# EAGLE design TPS2511 (EAGLE 6.4)
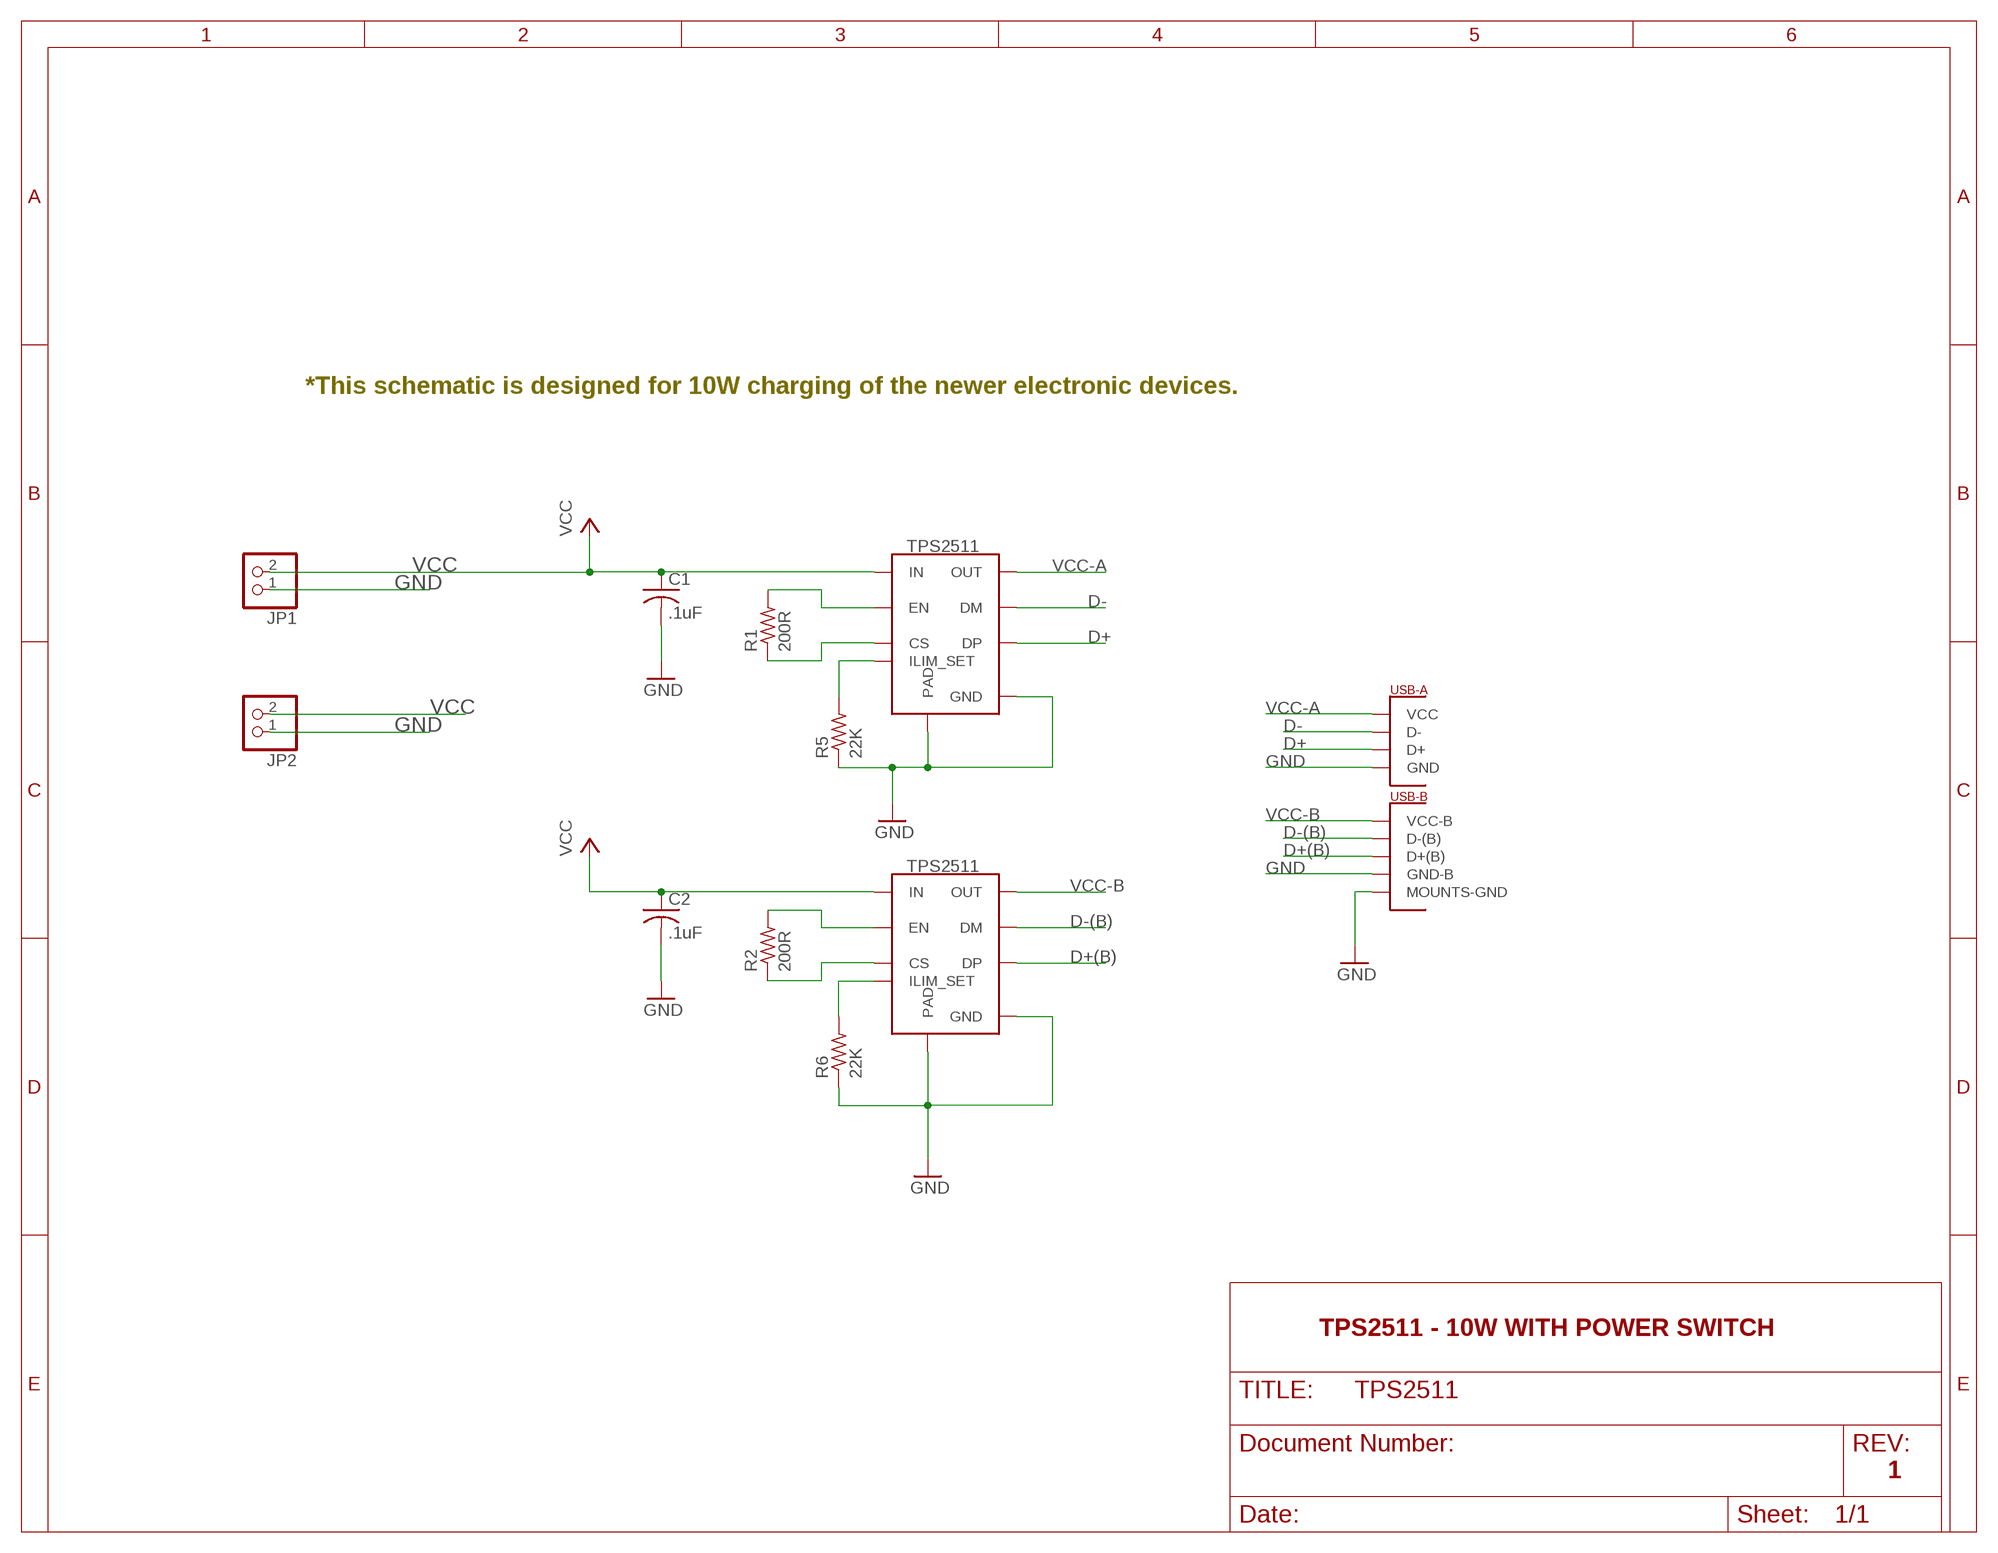
[diagram p0: schematic, sheet 1]

## Parts
C1  .1uF  C-US050-024X044  [C050-024X044]
C2  .1uF  C-US050-024X044  [C050-024X044]
JP1  PINHD-1X2/90  [1X02/90]
JP2  PINHD-1X2/90  [1X02/90]
R1  200R  R-US_0204/7  [0204/7]
R2  200R  R-US_0204/7  [0204/7]
R5  22K  R-US_0204/7  [0204/7]
R6  22K  R-US_0204/7  [0204/7]
U$1  TPS2511-MSOP8  [MSOP-8]
U$2  DUAL-PORT-USB-REC  [DUAL-PORT-USB]
U$3  TPS2511-MSOP8  [MSOP-8]

## Nets
D+: U$1.P$6(DP) U$2.P$8(D+)
D+(B): U$2.P$6(D+(B)) U$3.P$6(DP)
D-: U$1.P$7(DM) U$2.P$7(D-)
D-(B): U$2.P$5(D-(B)) U$3.P$7(DM)
GND: C1.2 C2.2 JP1.1 JP2.1 R5.1 R6.1 U$1.P$1(GND) U$1.P$9(PAD) U$2.GND(MOUNTS-GND) U$2.P$2(MOUNTS-GND) U$2.P$3(MOUNTS-GND) U$2.P$4(MOUNTS-GND) U$2.P$9(GND-B) U$2.P$11(GND) U$3.P$1(GND) U$3.P$9(PAD)
N$1: R5.2 U$1.P$2(ILIM_SET)
N$6: R6.2 U$3.P$2(ILIM_SET)
N$20: R1.2 U$1.P$5(EN)
N$21: R1.1 U$1.P$4(CS)
N$22: R2.2 U$3.P$5(EN)
N$23: R2.1 U$3.P$4(CS)
VCC: C1.1 C2.1 JP1.2 JP2.2 U$1.P$3(IN) U$3.P$3(IN)
VCC-A: U$1.P$8(OUT) U$2.P$12(VCC)
VCC-B: U$2.P$10(VCC-B) U$3.P$8(OUT)

## Notes on the sheet
- *This schematic is designed for 10W charging of the newer electronic devices.
- TPS2511 - 10W WITH POWER SWITCH
- 1

## Library data of the parts
C1 C2 = resistor:C-US: CAPACITOR, American symbol
JP1 JP2 = pinhead:PINHD-1X2: PIN HEADER
R1 R2 R5 R6 = resistor:R-US_: RESISTOR, American symbol
U$1 U$3 = Custom:TPS2511-MSOP8: TPS2511 in MSOP 8 pin package
U$2 = Custom:DUAL-PORT-USB-REC: Dual USB Receptacle, Horizontal.

## Board
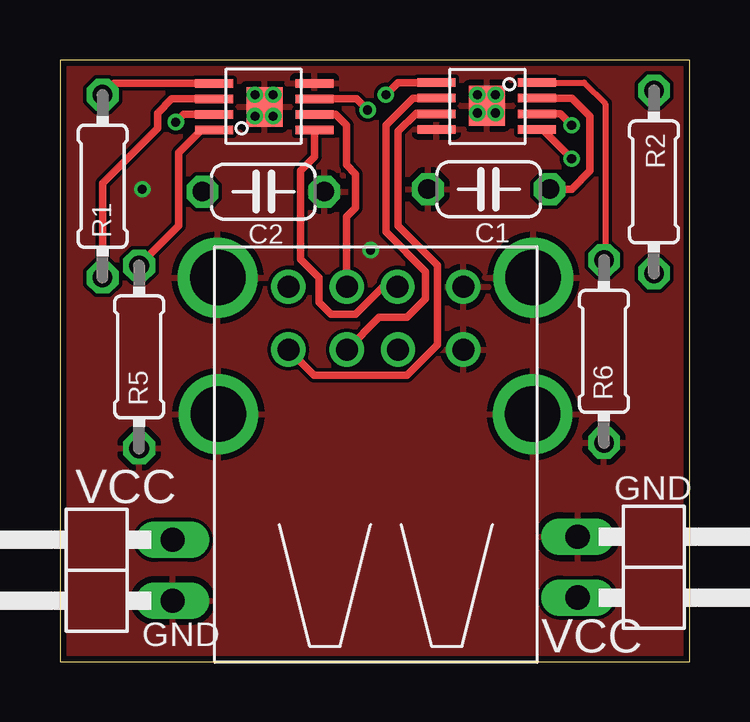
[diagram p1: board, top side]
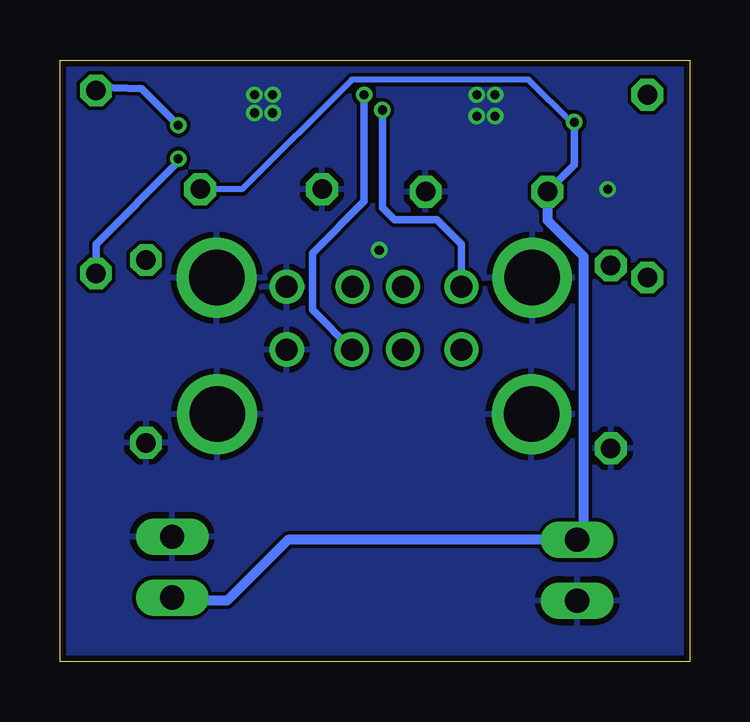
[diagram p2: board, bottom side, seen from below]

Size 26.27 x 25.07 mm. Coordinates in mm from the lower left corner, seen from the top.
Outline: 0,0 26.27,0 26.27,25.07 0,25.07 0,0
Copper layers (1*16): Top 0.035mm / dielectric 1.5mm / Bottom 0.035mm
Design rules "ITEADstudio_DRC": minimum track width 6mil, minimum drill 12mil, track to track 6mil, track to pad 6mil, pad to pad 6mil, via to via 6mil, smd to smd 0mil, copper to edge 10mil, drill to drill 10mil, minimum pad ring 10mil, minimum via ring 6mil, stop-mask expansion 2mil, vias tented up to drill 100mil, thermal gap 10mil

### Footprints (pad centres in the part's own frame; a part is rotated, then mirrored left to right if it is on the bottom)
C050-024X044 = drill 0.813 octagon: 1 -2.54,0; 2 2.54,0
1X02/90 = drill 1.016 long: 1 -1.27,-3.81; 2 1.27,-3.81
0204/7 = drill 0.813 octagon: 1 -3.81,0; 2 3.81,0
MSOP-8 = smd 1.65 x 1.5: P$1 -2.286,2.095 | smd 0.356 x 1.575: P$2 -3.25,4.188; P$3 -2.6,4.188; P$4 -1.95,4.188; P$5 -1.3,4.188; P$6 -3.25,0; P$7 -2.6,0; P$8 -1.95,0; P$9 -1.3,0
DUAL-PORT-USB = drill 2.311: GND -7.645,0.127; P$2 -7.62,-5.563; P$3 5.512,0.127; P$4 5.486,-5.563 | drill 0.92: P$5 -2.261,-2.87; P$6 -0.127,-2.87; P$7 -2.261,-0.254; P$8 -0.152,-0.254; P$9 2.591,-2.87; P$10 -4.699,-2.87; P$11 2.591,-0.254; P$12 -4.699,-0.254

### Placement (x,y rotation side)
C1  17.88,19.68 180 top
C2  8.48,19.58 0 top
JP1  0.89,3.81 90 top
JP2  25.4,3.94 270 top
R1  1.78,19.81 90 top
R2  24.77,19.99 270 top
R5  3.3,12.7 90 top
R6  22.68,12.93 90 top
U$1  10.62,25.4 90 top
U$2  14.22,15.88 0 top
U$3  15.7,20.88 270 top

### Tracks (layer width: path | path; a pad name or v marks a point on that pad's centre or on a via)
D+
  Top 0.305: U$1.P$6 10.62,21.03 10.03,20.45 10.03,16.76 10.79,16 10.79,14.99 11.3,14.48 12.32,14.48 13.46,15.62 U$2.P$8
D+(B)  (via drill 0.38)
  Top 0.305: U$3.P$6 14.1,24.13 v13.59,23.62
  Bottom 0.305: v13.59,23.62 13.59,19.18 15.75,17.02 15.75,14.66 U$2.P$6
D-
  Top 0.305: U$1.P$7 11.49,22.8 11.94,22.35 11.94,20.7 12.32,20.32 12.32,18.92 11.94,18.54 11.94,16.28 U$2.P$7
D-(B)
  Top 0.305: U$3.P$7 14.72,23.48 13.59,22.35 13.59,17.91 15.24,16.26 15.24,15.11 14.48,14.35 13.31,14.35 U$2.P$5
GND  (via drill 0.38)
  other vias: 8.13,22.73 8.13,23.62 8.89,23.62 8.89,22.73 17.4,23.62 17.4,22.86 18.16,23.62 18.16,22.86 3.43,19.68 12.95,17.14
  pour Top: 0.25,24.77 26.04,24.77 26.04,0.25 0.25,0.25
  pour Bottom: 0.25,24.77 26.04,24.77 26.04,0.25 0.25,0.25
N$1
  Top 0.305: U$1.P$2 5.89,22.15 4.95,21.21 4.95,18.16 R5.2
N$6
  Top 0.254: U$3.P$2 21.85,24.13 22.73,23.24 22.73,16.79 R6.2
N$20
  Top 0.305: U$1.P$5 2.26,24.1 R1.2
N$21
  Top 0.305: U$1.P$4 4.65,23.45 4.06,22.86 4.06,22.23 1.78,19.94 R1.1
N$22  (via drill 0.38)
  Top 0.305: U$3.P$5 20.11,22.18 v21.34,20.95
  Bottom 0.305: v21.34,20.95 21.34,20.83 24.77,17.4 R2.2
N$23  (via drill 0.38)
  Top 0.305: U$3.P$4 20.86,22.83 v21.34,22.35
  Bottom 0.305: v21.34,22.35 22.86,23.88 24.64,23.93 R2.1
VCC  (via drill 0.38)
  Top 0.305: U$3.P$3 21.35,23.48 22.1,22.73 22.1,20.45 21.34,19.68 C1.1 | U$1.P$3 5.15,22.8 v4.83,22.48
  Bottom 0.254: v4.83,22.48 4.95,22.48 6.73,24.26 14.1,24.26 18.67,19.68 C1.1
  Bottom 0.305: v4.83,22.48 4.83,20.7 C2.1
  Bottom 0.406: C2.1 5.94,18.39 4.45,16.89 4.45,5.33 JP1.2 16.76,5.08 19.3,2.54 21.46,2.54 JP2.2
VCC-A  (via drill 0.38)
  Top 0.305: U$1.P$8 12.36,23.45 v12.83,22.99
  Bottom 0.305: v12.83,22.99 12.83,18.92 12.32,18.41 10.54,18.41 9.53,17.4 U$2.P$12
VCC-B
  Top 0.305: U$3.P$8 15.53,22.83 15.49,22.86 14.86,22.86 14.1,22.1 14.1,18.16 15.75,16.51 15.75,13.21 14.48,11.94 10.59,11.94 U$2.P$10

### Text on the board
tNames: VCC | GND | GND | VCC